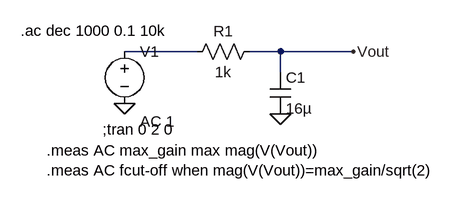
[diagram p0: schematic LPF.asc]
LPF.asc, the LTspice schematic file:
Version 4
SHEET 1 880 680
WIRE 176 160 64 160
WIRE 304 160 256 160
WIRE 416 160 304 160
WIRE 304 192 304 160
FLAG 64 240 0
FLAG 304 256 0
FLAG 416 160 Vout
SYMBOL voltage 64 144 R0
WINDOW 123 24 124 Left 2
WINDOW 39 0 0 Left 0
SYMATTR InstName V1
SYMATTR Value ""
SYMATTR Value2 AC 1
SYMBOL res 272 144 R90
WINDOW 0 0 56 VBottom 2
WINDOW 3 32 56 VTop 2
SYMATTR InstName R1
SYMATTR Value 1k
SYMBOL cap 288 192 R0
SYMATTR InstName C1
SYMATTR Value 16µ
TEXT 30 280 Left 2 !;tran 0 2 0
TEXT -96 128 Left 2 !.ac dec 1000 0.1 10k
TEXT -56 312 Left 2 !.meas AC max_gain max mag(V(Vout))\n.meas AC fcut-off when mag(V(Vout))=max_gain/sqrt(2)

The netlist it stands for:
* LPF.asc
V1 N001 0 AC 1
R1 Vout N001 1k
C1 Vout 0 16µ
;tran 0 2 0
.ac dec 1000 0.1 10k
.meas AC max_gain max mag(V(Vout))
.meas AC fcut-off when mag(V(Vout))=max_gain/sqrt(2)
.backanno
.end